# EAGLE design Relays_Multiplexer (EAGLE 9.3.0)
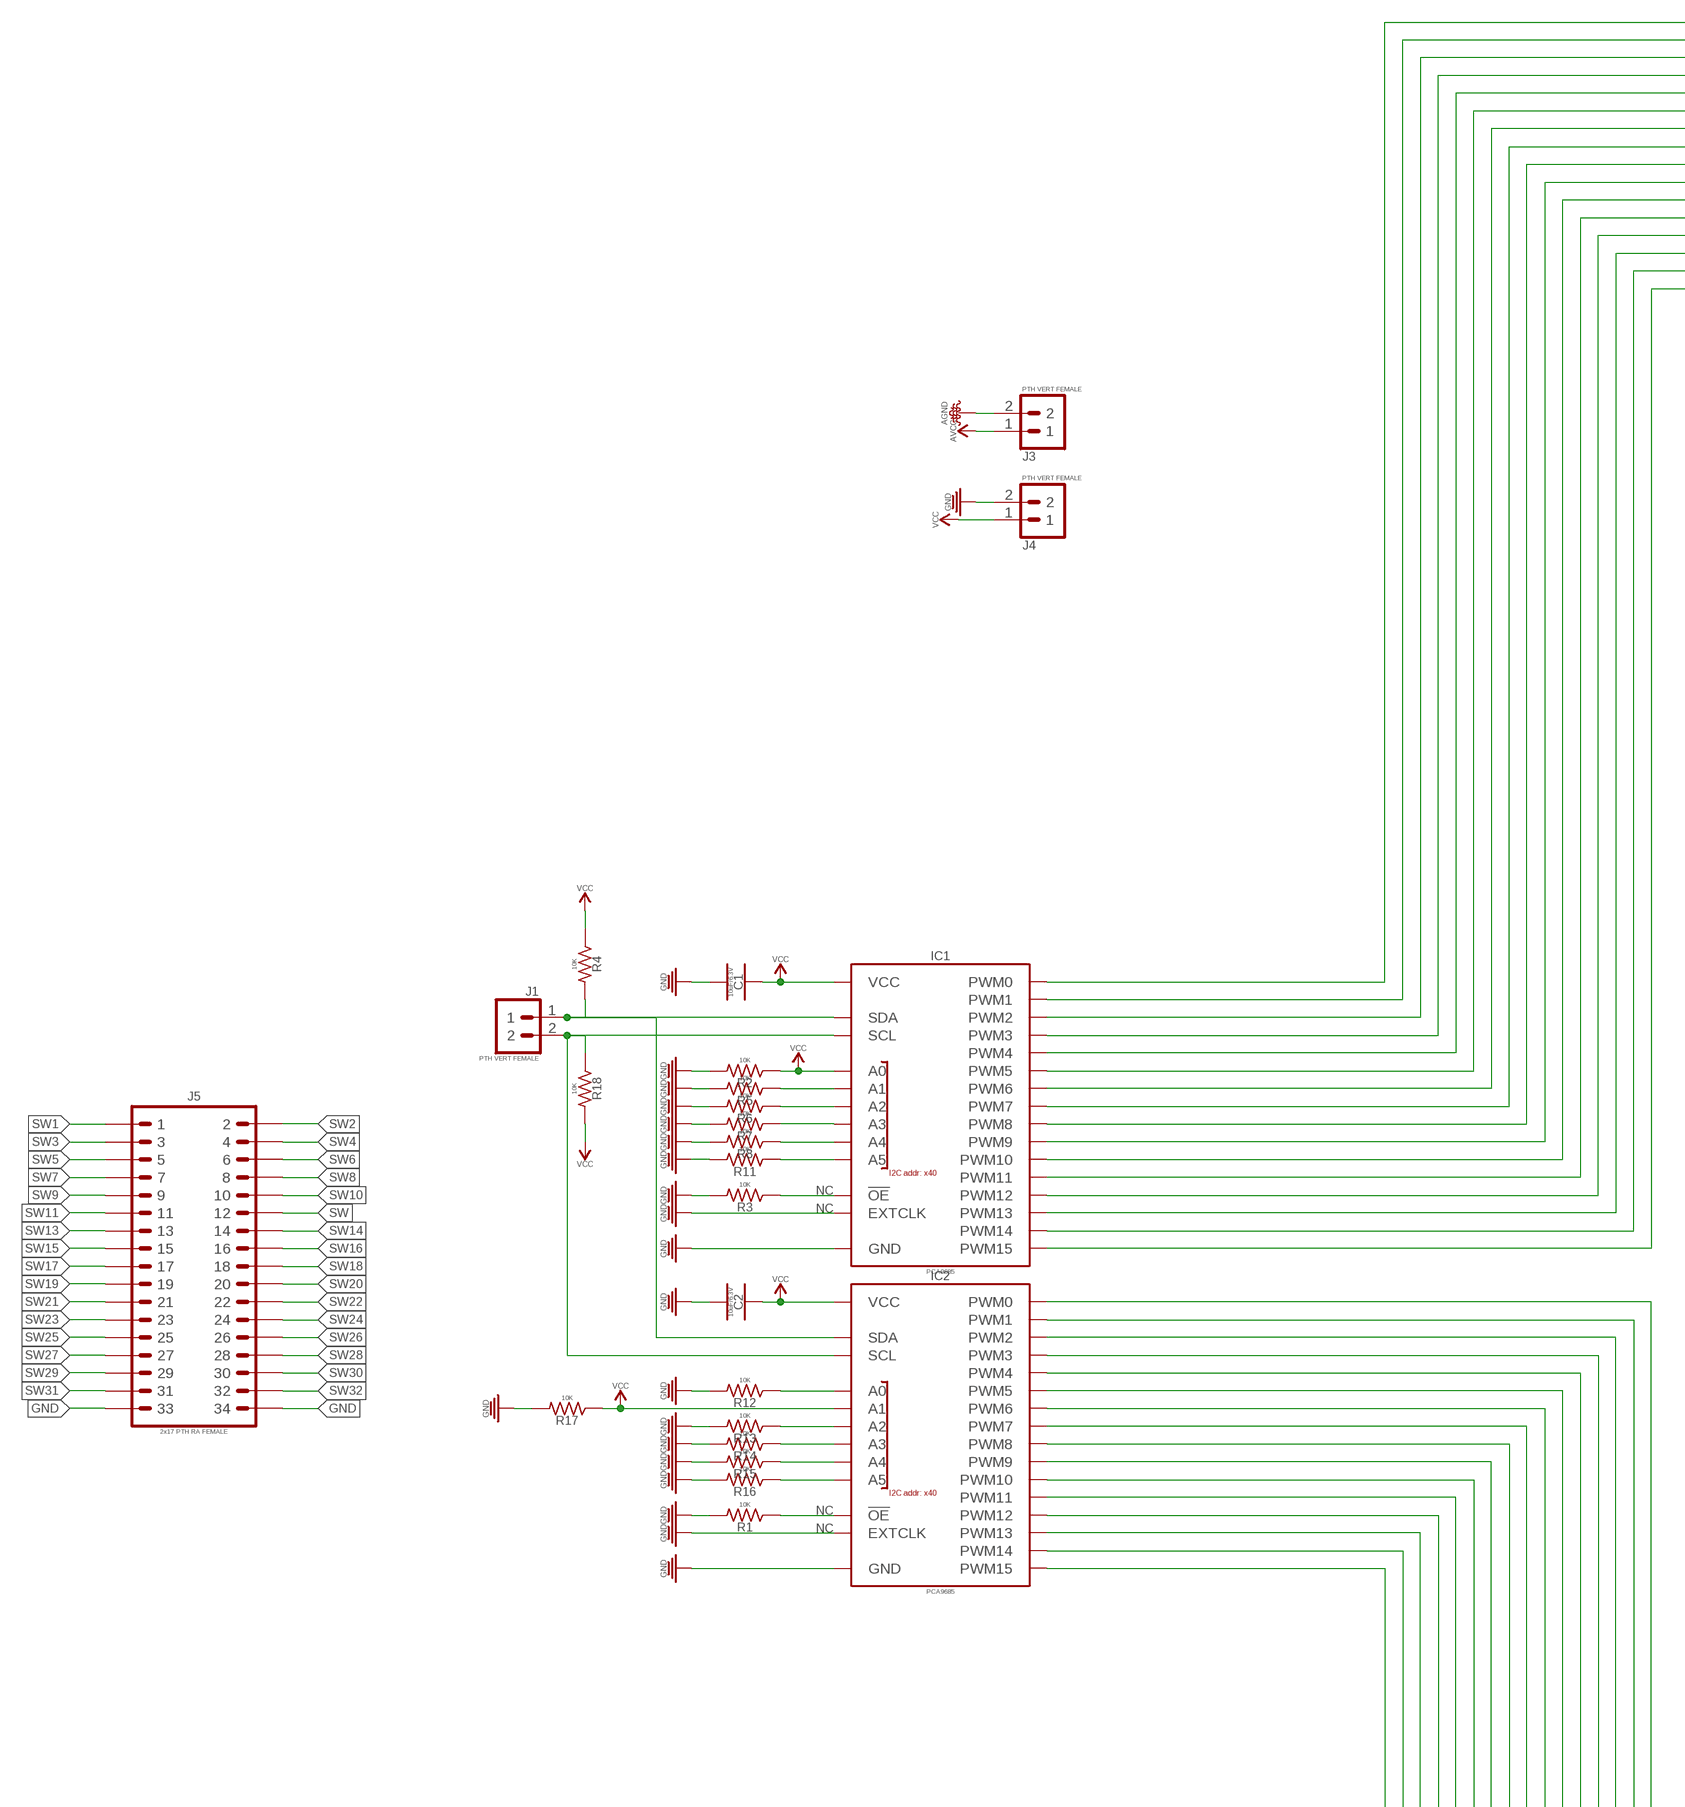
[diagram p0: schematic, sheet 1, part 1 of 3]
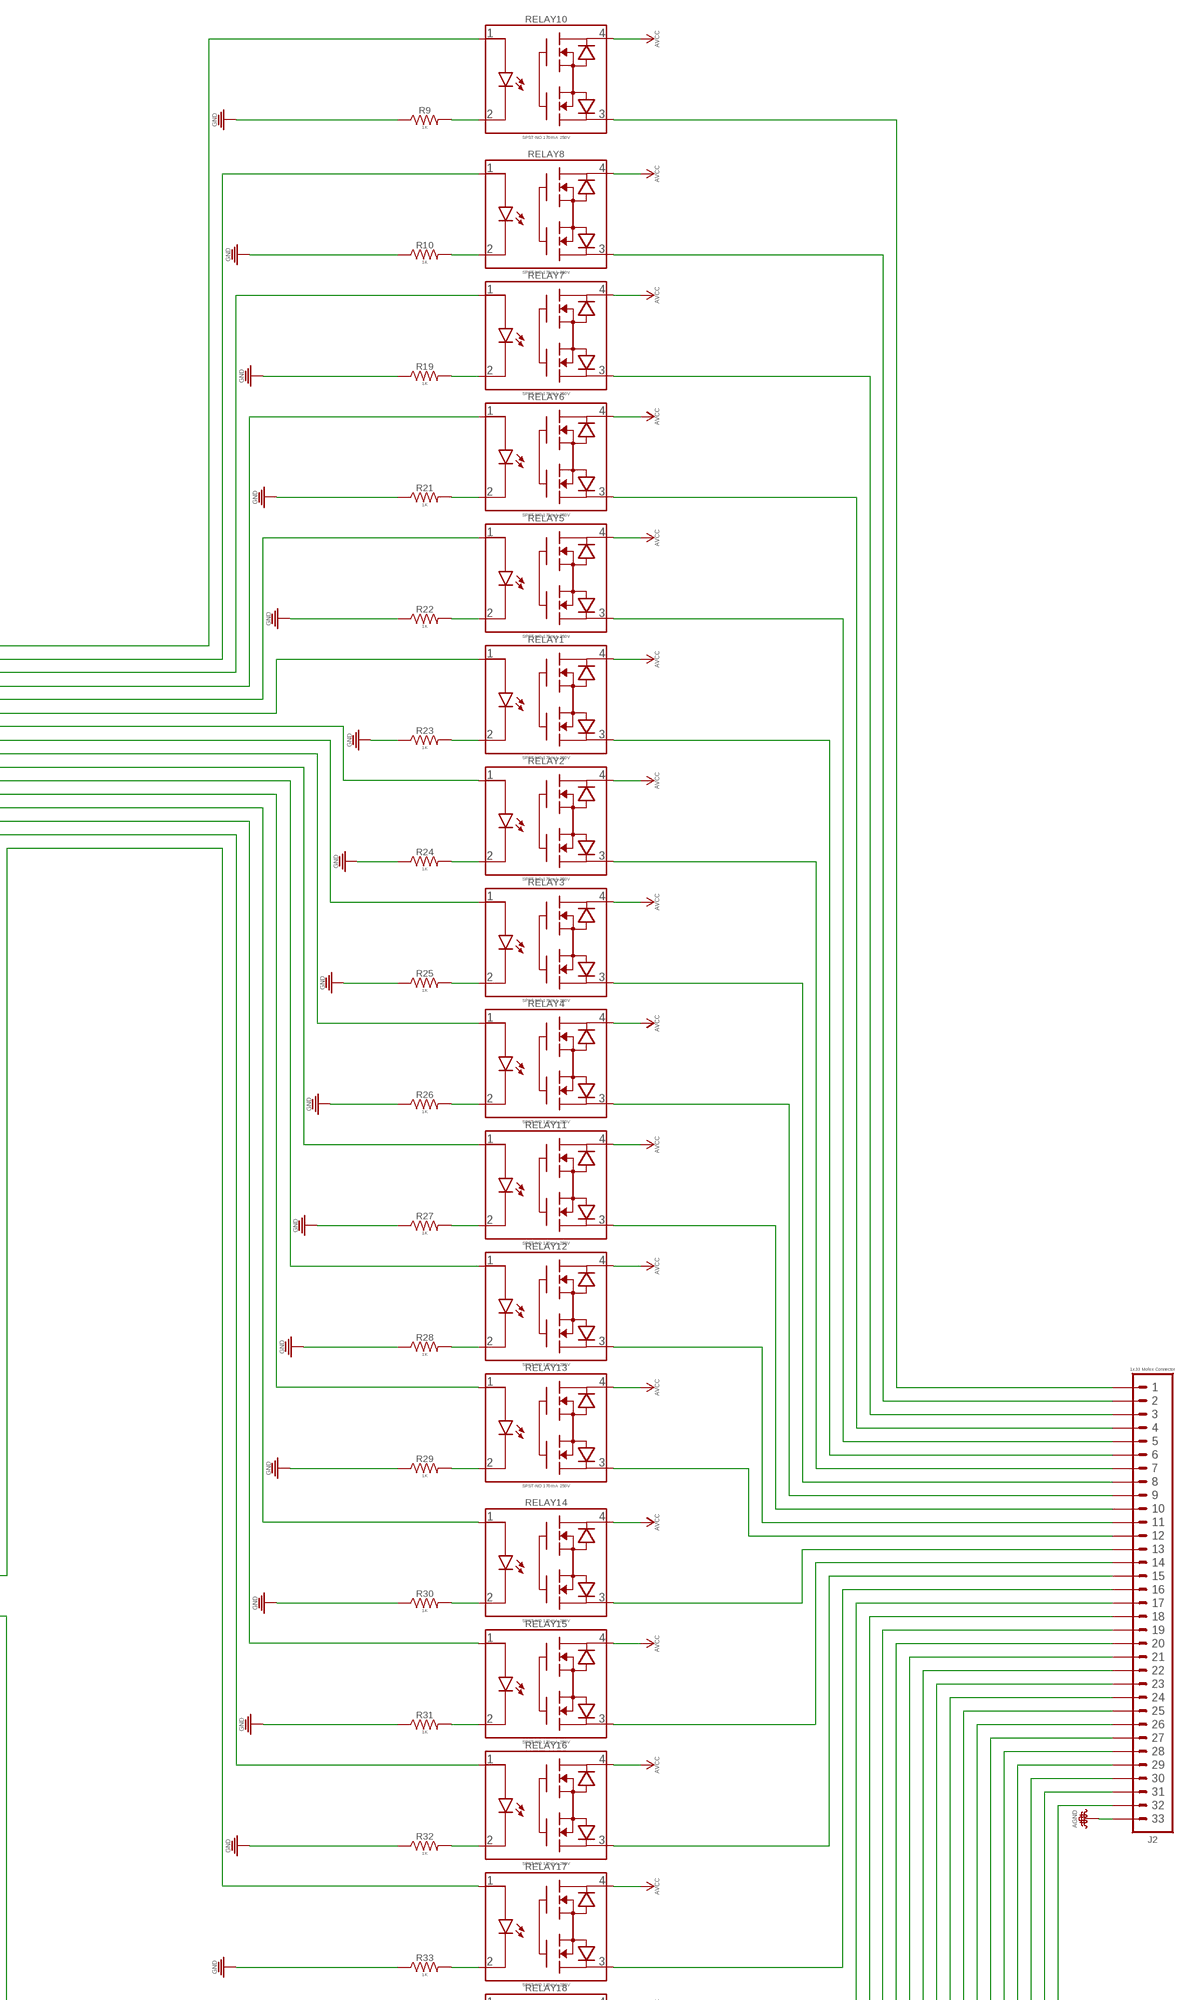
[diagram p1: schematic, sheet 1, part 2 of 3]
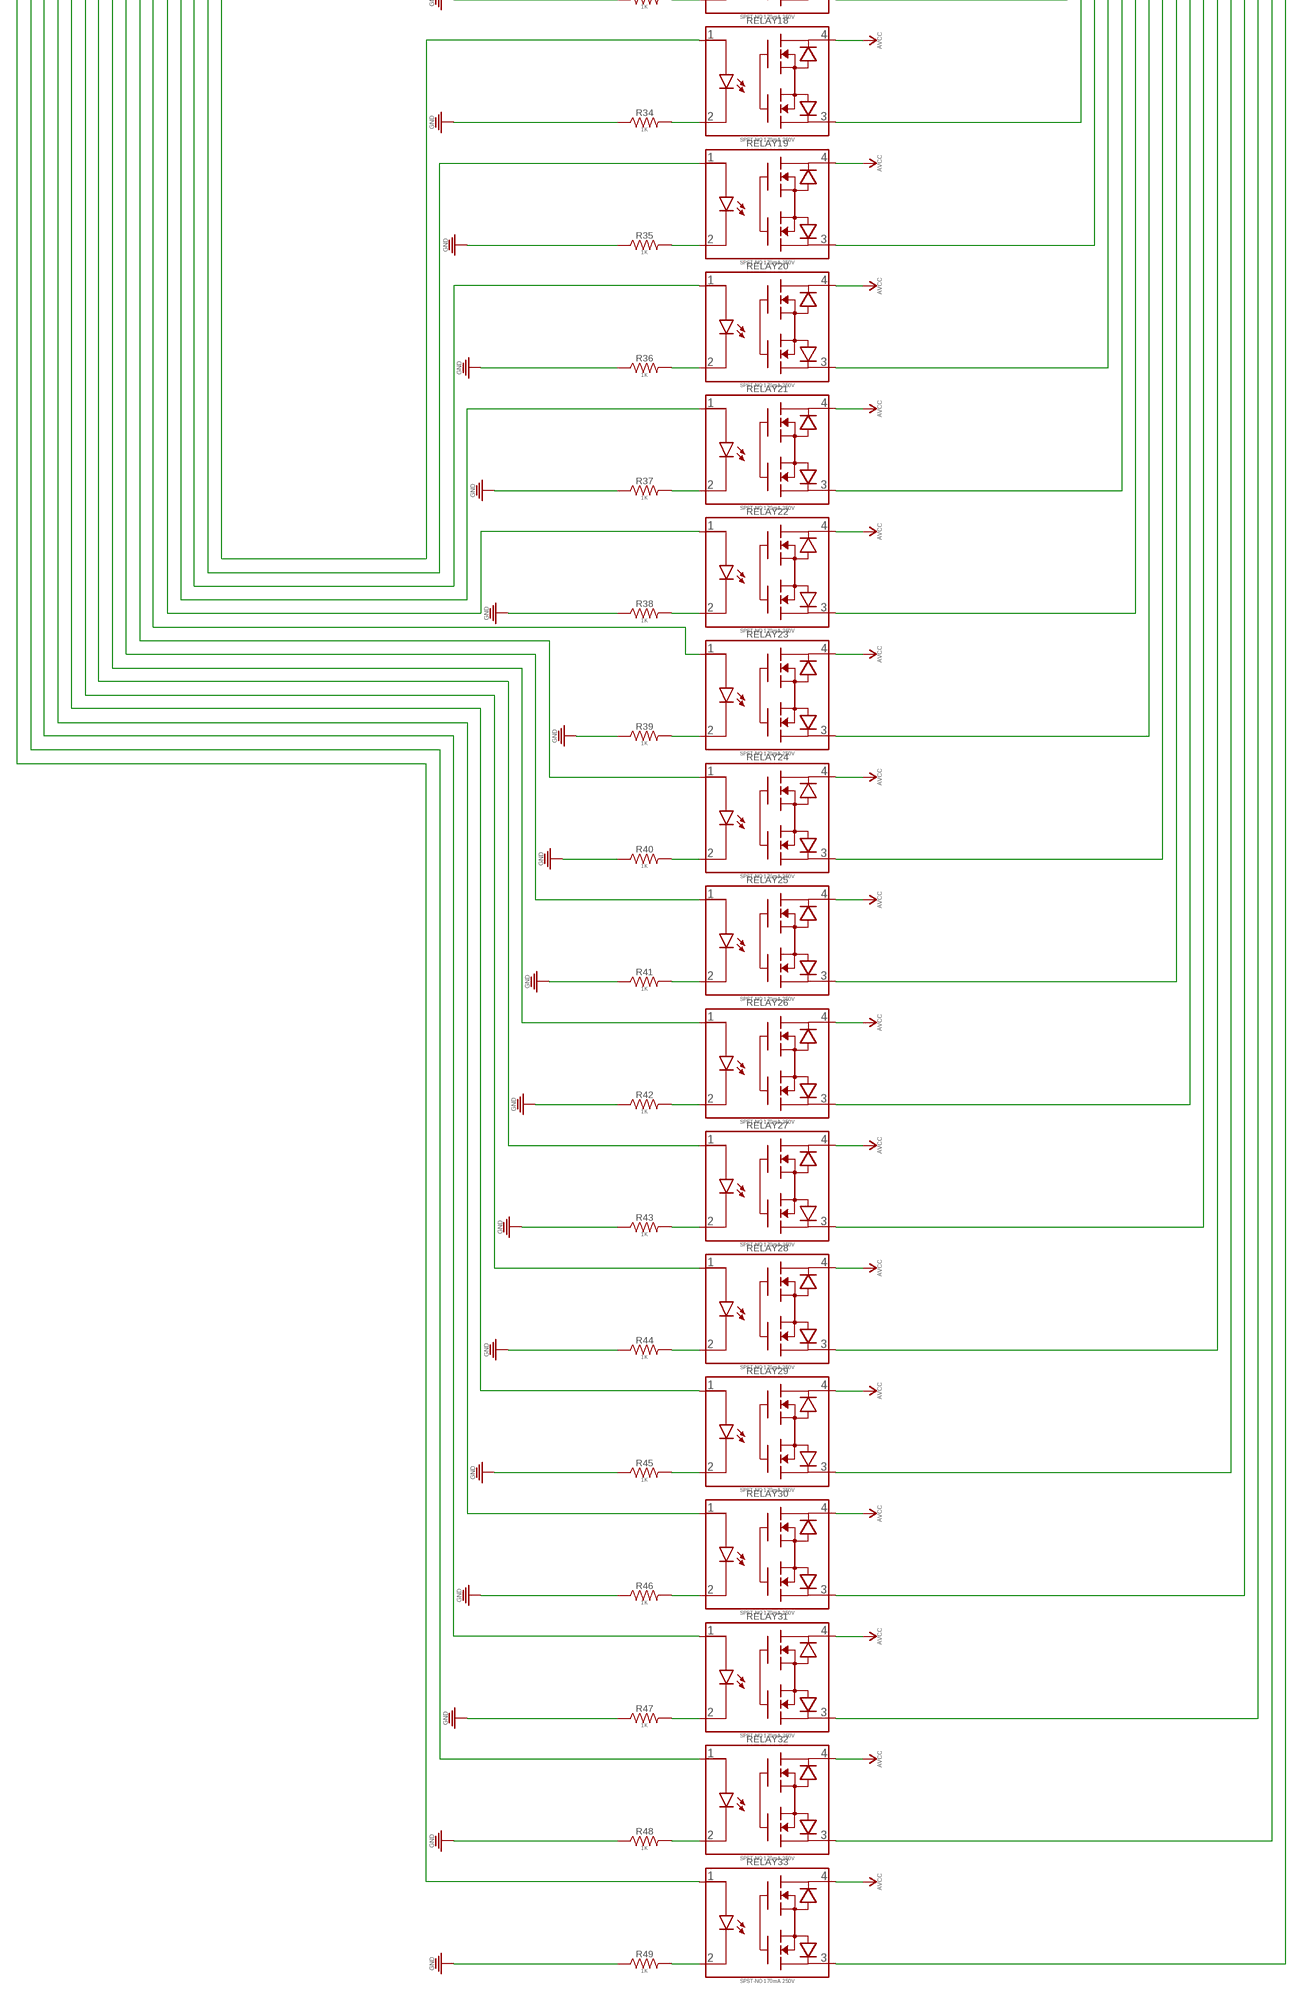
[diagram p2: schematic, sheet 1, part 3 of 3]

## Parts
C1  10uF/6.3V  10UF_CER_SMD-0402_6.3V-20%  [CAPC1005X55_SMD-0402]
C2  10uF/6.3V  10UF_CER_SMD-0402_6.3V-20%  [CAPC1005X55_SMD-0402]
IC1  PCA9685  PCA9685_16-CH_12-BIT_PWM-DRIVER_TSSOP-28_PWM-DRIVER_16CH  [SOP65P650X110-28]
IC2  PCA9685  PCA9685_16-CH_12-BIT_PWM-DRIVER_TSSOP-28_PWM-DRIVER_16CH  [SOP65P650X110-28]
J1  PTH VERT FEMALE  1X02_PTH_VERT_FEMALE_2.54MM  [HDRVR2W64P254_1X2_558X254X850B]
J2  1x33 Molex Connector  1X33_MOLEX_FPC_FPC_RIBBON-CABLE  [_MOLEX-5025983393_FPC_PITCH-0.3MM]
J3  PTH VERT FEMALE  1X02_PTH_VERT_FEMALE_2.54MM  [HDRVR2W64P254_1X2_558X254X850B]
J4  PTH VERT FEMALE  1X02_PTH_VERT_FEMALE_2.54MM  [HDRVR2W64P254_1X2_558X254X850B]
J5  2x17 PTH RA FEMALE  2X17_PTH_RA-FEMALE  [2X17-RA-FEMALE]
R1  10K  10KΩ_SMD-0402_1/16W-5%  [RESC1005X35_SMD-0402]
R2  10K  10KΩ_SMD-0402_1/16W-5%  [RESC1005X35_SMD-0402]
R3  10K  10KΩ_SMD-0402_1/16W-5%  [RESC1005X35_SMD-0402]
R4  10K  10KΩ_SMD-0402_1/16W-5%  [RESC1005X35_SMD-0402]
R5  10K  10KΩ_SMD-0402_1/16W-5%  [RESC1005X35_SMD-0402]
R6  10K  10KΩ_SMD-0402_1/16W-5%  [RESC1005X35_SMD-0402]
R7  10K  10KΩ_SMD-0402_1/16W-5%  [RESC1005X35_SMD-0402]
R8  10K  10KΩ_SMD-0402_1/16W-5%  [RESC1005X35_SMD-0402]
R9  1K  1KΩ_SMD-0402_1/16W-5%  [RESC1005X35_SMD-0402]
R10  1K  1KΩ_SMD-0402_1/16W-5%  [RESC1005X35_SMD-0402]
R11  10K  10KΩ_SMD-0402_1/16W-5%  [RESC1005X35_SMD-0402]
R12  10K  10KΩ_SMD-0402_1/16W-5%  [RESC1005X35_SMD-0402]
R13  10K  10KΩ_SMD-0402_1/16W-5%  [RESC1005X35_SMD-0402]
R14  10K  10KΩ_SMD-0402_1/16W-5%  [RESC1005X35_SMD-0402]
R15  10K  10KΩ_SMD-0402_1/16W-5%  [RESC1005X35_SMD-0402]
R16  10K  10KΩ_SMD-0402_1/16W-5%  [RESC1005X35_SMD-0402]
R17  10K  10KΩ_SMD-0402_1/16W-5%  [RESC1005X35_SMD-0402]
R18  10K  10KΩ_SMD-0402_1/16W-5%  [RESC1005X35_SMD-0402]
R19  1K  1KΩ_SMD-0402_1/16W-5%  [RESC1005X35_SMD-0402]
R21  1K  1KΩ_SMD-0402_1/16W-5%  [RESC1005X35_SMD-0402]
R22  1K  1KΩ_SMD-0402_1/16W-5%  [RESC1005X35_SMD-0402]
R23  1K  1KΩ_SMD-0402_1/16W-5%  [RESC1005X35_SMD-0402]
R24  1K  1KΩ_SMD-0402_1/16W-5%  [RESC1005X35_SMD-0402]
R25  1K  1KΩ_SMD-0402_1/16W-5%  [RESC1005X35_SMD-0402]
R26  1K  1KΩ_SMD-0402_1/16W-5%  [RESC1005X35_SMD-0402]
R27  1K  1KΩ_SMD-0402_1/16W-5%  [RESC1005X35_SMD-0402]
R28  1K  1KΩ_SMD-0402_1/16W-5%  [RESC1005X35_SMD-0402]
R29  1K  1KΩ_SMD-0402_1/16W-5%  [RESC1005X35_SMD-0402]
R30  1K  1KΩ_SMD-0402_1/16W-5%  [RESC1005X35_SMD-0402]
R31  1K  1KΩ_SMD-0402_1/16W-5%  [RESC1005X35_SMD-0402]
R32  1K  1KΩ_SMD-0402_1/16W-5%  [RESC1005X35_SMD-0402]
R33  1K  1KΩ_SMD-0402_1/16W-5%  [RESC1005X35_SMD-0402]
R34  1K  1KΩ_SMD-0402_1/16W-5%  [RESC1005X35_SMD-0402]
R35  1K  1KΩ_SMD-0402_1/16W-5%  [RESC1005X35_SMD-0402]
R36  1K  1KΩ_SMD-0402_1/16W-5%  [RESC1005X35_SMD-0402]
R37  1K  1KΩ_SMD-0402_1/16W-5%  [RESC1005X35_SMD-0402]
R38  1K  1KΩ_SMD-0402_1/16W-5%  [RESC1005X35_SMD-0402]
R39  1K  1KΩ_SMD-0402_1/16W-5%  [RESC1005X35_SMD-0402]
R40  1K  1KΩ_SMD-0402_1/16W-5%  [RESC1005X35_SMD-0402]
R41  1K  1KΩ_SMD-0402_1/16W-5%  [RESC1005X35_SMD-0402]
R42  1K  1KΩ_SMD-0402_1/16W-5%  [RESC1005X35_SMD-0402]
R43  1K  1KΩ_SMD-0402_1/16W-5%  [RESC1005X35_SMD-0402]
R44  1K  1KΩ_SMD-0402_1/16W-5%  [RESC1005X35_SMD-0402]
R45  1K  1KΩ_SMD-0402_1/16W-5%  [RESC1005X35_SMD-0402]
R46  1K  1KΩ_SMD-0402_1/16W-5%  [RESC1005X35_SMD-0402]
R47  1K  1KΩ_SMD-0402_1/16W-5%  [RESC1005X35_SMD-0402]
R48  1K  1KΩ_SMD-0402_1/16W-5%  [RESC1005X35_SMD-0402]
R49  1K  1KΩ_SMD-0402_1/16W-5%  [RESC1005X35_SMD-0402]
RELAY1  SPST-NO 170mA 250V  RELAY_SOLID-STATE_SSR_170MA_250V_SPST-NO  [SOP254P609X203-4]
RELAY2  SPST-NO 170mA 250V  RELAY_SOLID-STATE_SSR_170MA_250V_SPST-NO  [SOP254P609X203-4]
RELAY3  SPST-NO 170mA 250V  RELAY_SOLID-STATE_SSR_170MA_250V_SPST-NO  [SOP254P609X203-4]
RELAY4  SPST-NO 170mA 250V  RELAY_SOLID-STATE_SSR_170MA_250V_SPST-NO  [SOP254P609X203-4]
RELAY5  SPST-NO 170mA 250V  RELAY_SOLID-STATE_SSR_170MA_250V_SPST-NO  [SOP254P609X203-4]
RELAY6  SPST-NO 170mA 250V  RELAY_SOLID-STATE_SSR_170MA_250V_SPST-NO  [SOP254P609X203-4]
RELAY7  SPST-NO 170mA 250V  RELAY_SOLID-STATE_SSR_170MA_250V_SPST-NO  [SOP254P609X203-4]
RELAY8  SPST-NO 170mA 250V  RELAY_SOLID-STATE_SSR_170MA_250V_SPST-NO  [SOP254P609X203-4]
RELAY10  SPST-NO 170mA 250V  RELAY_SOLID-STATE_SSR_170MA_250V_SPST-NO  [SOP254P609X203-4]
RELAY11  SPST-NO 170mA 250V  RELAY_SOLID-STATE_SSR_170MA_250V_SPST-NO  [SOP254P609X203-4]
RELAY12  SPST-NO 170mA 250V  RELAY_SOLID-STATE_SSR_170MA_250V_SPST-NO  [SOP254P609X203-4]
RELAY13  SPST-NO 170mA 250V  RELAY_SOLID-STATE_SSR_170MA_250V_SPST-NO  [SOP254P609X203-4]
RELAY14  SPST-NO 170mA 250V  RELAY_SOLID-STATE_SSR_170MA_250V_SPST-NO  [SOP254P609X203-4]
RELAY15  SPST-NO 170mA 250V  RELAY_SOLID-STATE_SSR_170MA_250V_SPST-NO  [SOP254P609X203-4]
RELAY16  SPST-NO 170mA 250V  RELAY_SOLID-STATE_SSR_170MA_250V_SPST-NO  [SOP254P609X203-4]
RELAY17  SPST-NO 170mA 250V  RELAY_SOLID-STATE_SSR_170MA_250V_SPST-NO  [SOP254P609X203-4]
RELAY18  SPST-NO 170mA 250V  RELAY_SOLID-STATE_SSR_170MA_250V_SPST-NO  [SOP254P609X203-4]
RELAY19  SPST-NO 170mA 250V  RELAY_SOLID-STATE_SSR_170MA_250V_SPST-NO  [SOP254P609X203-4]
RELAY20  SPST-NO 170mA 250V  RELAY_SOLID-STATE_SSR_170MA_250V_SPST-NO  [SOP254P609X203-4]
RELAY21  SPST-NO 170mA 250V  RELAY_SOLID-STATE_SSR_170MA_250V_SPST-NO  [SOP254P609X203-4]
RELAY22  SPST-NO 170mA 250V  RELAY_SOLID-STATE_SSR_170MA_250V_SPST-NO  [SOP254P609X203-4]
RELAY23  SPST-NO 170mA 250V  RELAY_SOLID-STATE_SSR_170MA_250V_SPST-NO  [SOP254P609X203-4]
RELAY24  SPST-NO 170mA 250V  RELAY_SOLID-STATE_SSR_170MA_250V_SPST-NO  [SOP254P609X203-4]
RELAY25  SPST-NO 170mA 250V  RELAY_SOLID-STATE_SSR_170MA_250V_SPST-NO  [SOP254P609X203-4]
RELAY26  SPST-NO 170mA 250V  RELAY_SOLID-STATE_SSR_170MA_250V_SPST-NO  [SOP254P609X203-4]
RELAY27  SPST-NO 170mA 250V  RELAY_SOLID-STATE_SSR_170MA_250V_SPST-NO  [SOP254P609X203-4]
RELAY28  SPST-NO 170mA 250V  RELAY_SOLID-STATE_SSR_170MA_250V_SPST-NO  [SOP254P609X203-4]
RELAY29  SPST-NO 170mA 250V  RELAY_SOLID-STATE_SSR_170MA_250V_SPST-NO  [SOP254P609X203-4]
RELAY30  SPST-NO 170mA 250V  RELAY_SOLID-STATE_SSR_170MA_250V_SPST-NO  [SOP254P609X203-4]
RELAY31  SPST-NO 170mA 250V  RELAY_SOLID-STATE_SSR_170MA_250V_SPST-NO  [SOP254P609X203-4]
RELAY32  SPST-NO 170mA 250V  RELAY_SOLID-STATE_SSR_170MA_250V_SPST-NO  [SOP254P609X203-4]
RELAY33  SPST-NO 170mA 250V  RELAY_SOLID-STATE_SSR_170MA_250V_SPST-NO  [SOP254P609X203-4]

## Nets
AGND: J2.P$33 J3.2
AVCC: J3.1 RELAY1.4 RELAY2.4 RELAY3.4 RELAY4.4 RELAY5.4 RELAY6.4 RELAY7.4 RELAY8.4 RELAY10.4 RELAY11.4 RELAY12.4 RELAY13.4 RELAY14.4 RELAY15.4 RELAY16.4 RELAY17.4 RELAY18.4 RELAY19.4 RELAY20.4 RELAY21.4 RELAY22.4 RELAY23.4 RELAY24.4 RELAY25.4 RELAY26.4 RELAY27.4 RELAY28.4 RELAY29.4 RELAY30.4 RELAY31.4 RELAY32.4 RELAY33.4
GND: C1.2 C2.2 IC1.14(GND) IC1.25(EXTCLK) IC2.14(GND) IC2.25(EXTCLK) J4.2 J5.33 J5.34 R1.2 R2.2 R3.2 R5.2 R6.2 R7.2 R8.2 R9.1 R10.1 R11.2 R12.2 R13.2 R14.2 R15.2 R16.2 R17.2 R19.1 R21.1 R22.1 R23.1 R24.1 R25.1 R26.1 R27.1 R28.1 R29.1 R30.1 R31.1 R32.1 R33.1 R34.1 R35.1 R36.1 R37.1 R38.1 R39.1 R40.1 R41.1 R42.1 R43.1 R44.1 R45.1 R46.1 R47.1 R48.1 R49.1
N$1: IC1.23(!OE) R3.1
N$2: IC1.4(A3) R7.1
N$3: IC1.24(A5) R11.1
N$4: IC1.5(A4) R8.1
N$5: IC1.3(A2) R6.1
N$6: IC1.2(A1) R5.1
N$7: IC2.1(A0) R12.1
N$8: IC2.3(A2) R13.1
N$9: IC2.4(A3) R14.1
N$10: IC2.5(A4) R15.1
N$11: IC2.24(A5) R16.1
N$12: IC2.23(!OE) R1.1
N$17: J2.P$17 RELAY18.3
N$18: J2.P$16 RELAY17.3
N$19: J2.P$15 RELAY16.3
N$20: J2.P$14 RELAY15.3
N$21: J2.P$13 RELAY14.3
N$22: J2.P$12 RELAY13.3
N$23: J2.P$11 RELAY12.3
N$24: J2.P$10 RELAY11.3
N$25: J2.P$9 RELAY4.3
N$26: J2.P$8 RELAY3.3
N$27: J2.P$7 RELAY2.3
N$28: J2.P$6 RELAY1.3
N$29: J2.P$5 RELAY5.3
N$30: J2.P$4 RELAY6.3
N$31: J2.P$3 RELAY7.3
N$32: J2.P$2 RELAY8.3
N$33: J2.P$1 RELAY10.3
N$34: J2.P$18 RELAY19.3
N$35: J2.P$19 RELAY20.3
N$36: J2.P$20 RELAY21.3
N$37: J2.P$21 RELAY22.3
N$38: J2.P$22 RELAY23.3
N$39: J2.P$23 RELAY24.3
N$40: J2.P$24 RELAY25.3
N$41: J2.P$25 RELAY26.3
N$42: J2.P$26 RELAY27.3
N$43: J2.P$27 RELAY28.3
N$44: J2.P$28 RELAY29.3
N$45: J2.P$29 RELAY30.3
N$46: J2.P$30 RELAY31.3
N$52: J2.P$31 RELAY32.3
N$53: J2.P$32 RELAY33.3
N$79: R19.2 RELAY7.2
N$80: R21.2 RELAY6.2
N$81: R9.2 RELAY10.2
N$82: R10.2 RELAY8.2
N$83: R22.2 RELAY5.2
N$84: R23.2 RELAY1.2
N$85: R24.2 RELAY2.2
N$86: R25.2 RELAY3.2
N$87: R26.2 RELAY4.2
N$88: R27.2 RELAY11.2
N$89: R28.2 RELAY12.2
N$90: R29.2 RELAY13.2
N$91: R30.2 RELAY14.2
N$92: R31.2 RELAY15.2
N$93: R32.2 RELAY16.2
N$94: R33.2 RELAY17.2
N$95: R34.2 RELAY18.2
N$96: R35.2 RELAY19.2
N$97: R36.2 RELAY20.2
N$98: R37.2 RELAY21.2
N$99: R38.2 RELAY22.2
N$100: R39.2 RELAY23.2
N$101: R40.2 RELAY24.2
N$102: R41.2 RELAY25.2
N$103: R42.2 RELAY26.2
N$104: R43.2 RELAY27.2
N$105: R44.2 RELAY28.2
N$106: R45.2 RELAY29.2
N$107: R46.2 RELAY30.2
N$108: R47.2 RELAY31.2
N$109: R48.2 RELAY32.2
N$110: R49.2 RELAY33.2
SCL: IC1.26(SCL) IC2.26(SCL) J1.2 R18.1
SDA: IC1.27(SDA) IC2.27(SDA) J1.1 R4.2
SW: IC1.18(PWM11) J5.12 RELAY13.1
SW1: IC1.6(PWM0) J5.1 RELAY10.1
SW2: IC1.7(PWM1) J5.2 RELAY8.1
SW3: IC1.8(PWM2) J5.3 RELAY7.1
SW4: IC1.9(PWM3) J5.4 RELAY6.1
SW5: IC1.10(PWM4) J5.5 RELAY5.1
SW6: IC1.11(PWM5) J5.6 RELAY1.1
SW7: IC1.12(PWM6) J5.7 RELAY2.1
SW8: IC1.13(PWM7) J5.8 RELAY3.1
SW9: IC1.15(PWM8) J5.9 RELAY4.1
SW10: IC1.16(PWM9) J5.10 RELAY11.1
SW11: IC1.17(PWM10) J5.11 RELAY12.1
SW13: IC1.19(PWM12) J5.13 RELAY14.1
SW14: IC1.20(PWM13) J5.14 RELAY15.1
SW15: IC1.21(PWM14) J5.15 RELAY16.1
SW16: IC1.22(PWM15) J5.16 RELAY17.1
SW17: IC2.6(PWM0) J5.17 RELAY18.1
SW18: IC2.7(PWM1) J5.18 RELAY19.1
SW19: IC2.8(PWM2) J5.19 RELAY20.1
SW20: IC2.9(PWM3) J5.20 RELAY21.1
SW21: IC2.10(PWM4) J5.21 RELAY22.1
SW22: IC2.11(PWM5) J5.22 RELAY23.1
SW23: IC2.12(PWM6) J5.23 RELAY24.1
SW24: IC2.13(PWM7) J5.24 RELAY25.1
SW25: IC2.15(PWM8) J5.25 RELAY26.1
SW26: IC2.16(PWM9) J5.26 RELAY27.1
SW27: IC2.17(PWM10) J5.27 RELAY28.1
SW28: IC2.18(PWM11) J5.28 RELAY29.1
SW29: IC2.19(PWM12) J5.29 RELAY30.1
SW30: IC2.20(PWM13) J5.30 RELAY31.1
SW31: IC2.21(PWM14) J5.31 RELAY32.1
SW32: IC2.22(PWM15) J5.32 RELAY33.1
VCC: C1.1 C2.1 IC1.1(A0) IC1.28(VCC) IC2.2(A1) IC2.28(VCC) J4.1 R2.1 R4.1 R17.1 R18.2

## Library data of the parts
C1 C2 = _capacitors:10UF; DATASHEET: https://www.murata.com/~/media/webrenewal/support/library/catalog/products/capacitor/mlcc/c02e.ashx; DIST: Digikey; DISTLINK: https://www.digikey.com/products/en?keywords=490-13233-1-ND; DISTPN: 490-13233-1-ND; MFR: Murata Electronics North America; MPN: GRM155C80J106ME11D
IC1 IC2 = _special:PCA9685_16-CH_12-BIT_PWM-DRIVER; DATASHEET: https://www.nxp.com/docs/en/data-sheet/PCA9685.pdf; DIST: Digikey; DISTLINK: https://www.digikey.com/products/en?keywords=568-11925-1-ND; DISTPN: 568-11925-1-ND; MFR: NXP USA Inc.; MPN: PCA9685PW,118
J1 J3 J4 = _connectors:1X02: 2 Positions Header Connector 0.079" (2.00mm) Through Hole Tin; DATASHEET: https://drawings-pdf.s3.amazonaws.com/10492.pdf; DIST: Digikey; DISTLINK: https://www.digikey.com/products/en?keywords=PPTC021LFBN-RC; DISTPN: S7000-ND; MFR: Sullins Connector Solutions; MPN: PPTC021LFBN-RC
J2 = _connectors:1X33_MOLEX_FPC; DATASHEET: https://www.molex.com/pdm_docs/sd/5025982593_sd.pdf; DATASHEET_CABLE: https://www.molex.com/pdm_docs/sd/150150423_sd.pdf; DIST: Digikey; DISTLINK: https://www.digikey.com/products/en?keywords=WM9775CT-ND; DISTLINK_CABLE: https://www.digikey.com/products/en?keywords=WM9647-ND; DISTPN: WM9775CT-ND; DISTPN_CABLE: WM9647-ND; DIST_CABLE: Digikey; MFR: Molex, LLC; MFR_CABLE: Molex, LLC; MPN: 5025983393; MPN_CABLE: 0150150233
J5 = _connectors:2X17; DATASHEET: http://suddendocs.samtec.com/prints/ssq-1xx-xx-xxx-x-xx-xxx-xx-x-mkt.pdf; DIST: Digikey; DISTLINK: https://www.digikey.com/products/en?keywords=SAM1224-17-ND; DISTPN: SAM1224-17-ND; MFR: Samtec Inc.; MPN: SSQ-117-02-T-D-RA
R1-R8 R11-R18 = _resistors:10KΩ; DATASHEET: http://www.yageo.com/NewPortal/yageodocoutput?fileName=/pdf/R-Chip/PYu-RC_51_RoHS_P_0.pdf; DIST: Digikey; DISTLINK: https://www.digikey.com/products/en?keywords=YAG1281CT-ND; DISTPN: YAG1281CT-ND; MFR: Yageo; MPN: RC0402JR-0710KP
R9 R10 R19 R21-R49 = _resistors:1KΩ; DATASHEET: http://www.yageo.com/documents/recent/PYu-RC_Group_51_RoHS_L_9.pdf; DIST: Digikey; DISTLINK: https://www.digikey.com/products/en?keywords=311-1.0KJRCT-ND; DISTPN: 311-1.0KJRCT-ND; MFR: Yageo; MPN: RC0402JR-071KL
RELAY1-RELAY8 RELAY10-RELAY33 = _relay:RELAY_SOLID-STATE; DATASHEET: http://www.ixysic.com/home/pdfs.nsf/www/CPC1010N.pdf/$file/CPC1010N.pdf; DIST: Digikey; DISTLINK: https://www.digikey.com/products/en?keywords=CPC1010N-ND; DISTPN: CPC1010N-ND; MFR: IXYS Integrated Circuits Division; MPN: CPC1010N

## Board
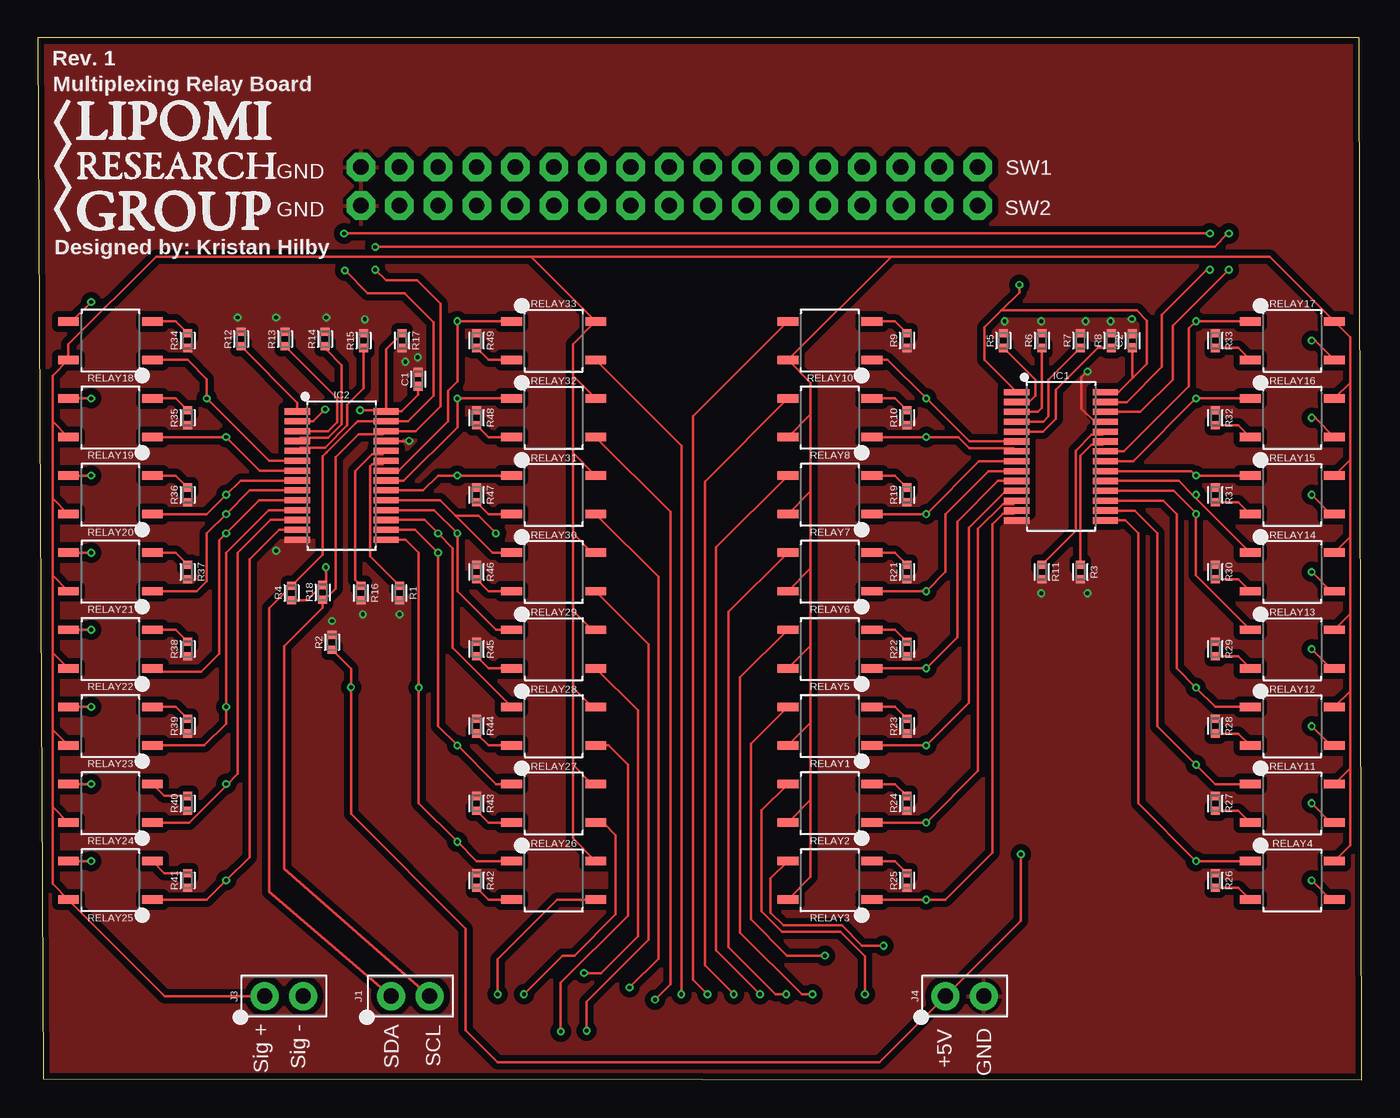
[diagram p3: board, top side]
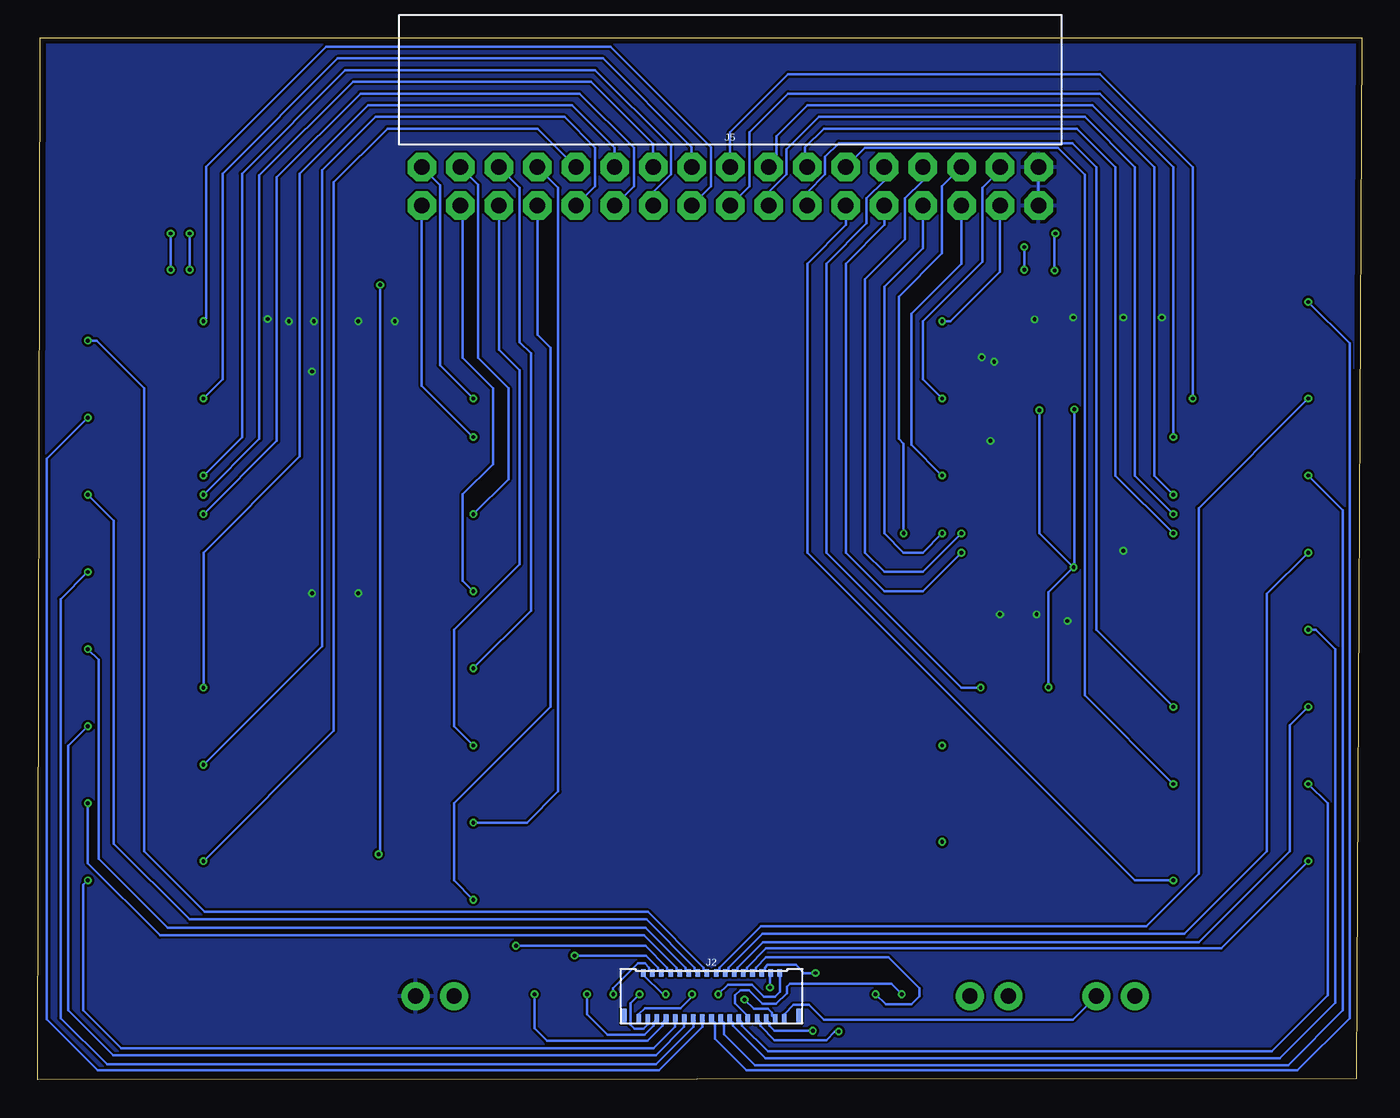
[diagram p4: board, bottom side, seen from below]

Size 87.23 x 68.62 mm. Coordinates in mm from the lower left corner, seen from the top.
Outline: 0.35,0.05 87.23,0 87.08,68.62 0,68.62 0.35,0.05
Copper layers (1*16): Top 0.035559375mm / dielectric 1.6mm / Bottom 0.035559375mm
Design rules "oshpark-2layer": minimum track width 6mil, minimum drill 10mil, track to track 6mil, track to pad 6mil, pad to pad 6mil, via to via 6mil, smd to smd 6mil, copper to edge 15mil, drill to drill 6mil, minimum pad ring 5mil, minimum via ring 5mil, stop-mask expansion 2.5mil, vias tented up to drill 0mil, thermal gap 10mil

### Footprints (pad centres in the part's own frame; a part is rotated, then mirrored left to right if it is on the bottom)
CAPC1005X55_SMD-0402 = smd 0.585 x 0.612: 1 -0.458,0; 2 0.458,0
SOP65P650X110-28 = smd 1.659 x 0.407: 1 -2.926,4.225; 2 -2.926,3.575; 3 -2.926,2.925; 4 -2.926,2.275; 5 -2.926,1.625; 6 -2.926,0.975; 7 -2.926,0.325; 8 -2.926,-0.325; 9 -2.926,-0.975; 10 -2.926,-1.625; 11 -2.926,-2.275; 12 -2.926,-2.925; 13 -2.926,-3.575; 14 -2.926,-4.225; 15 2.926,-4.225; 16 2.926,-3.575; 17 2.926,-2.925; 18 2.926,-2.275; 19 2.926,-1.625; 20 2.926,-0.975; 21 2.926,-0.325; 22 2.926,0.325; 23 2.926,0.975; 24 2.926,1.625; 25 2.926,2.275; 26 2.926,2.925; 27 2.926,3.575; 28 2.926,4.225
HDRVR2W64P254_1X2_558X254X850B = drill 1 pad 1.85: 1 0,0; 2 2.54,0
_MOLEX-5025983393_FPC_PITCH-0.3MM = smd 0.3 x 0.67: P$1 -4.8,-1.532; P$3 -4.2,-1.532; P$5 -3.6,-1.532; P$7 -3,-1.532; P$9 -2.4,-1.532; P$11 -1.8,-1.532; P$13 -1.2,-1.532; P$15 -0.6,-1.532; P$17 0,-1.532; P$19 0.6,-1.532; P$21 1.2,-1.532; P$23 1.8,-1.532; P$25 2.4,-1.532; P$27 3,-1.532; P$29 3.6,-1.532; P$31 4.2,-1.532; P$33 4.8,-1.532 | smd 0.3 x 0.5: P$2 -4.5,1.532; P$4 -3.9,1.532; P$6 -3.3,1.532; P$8 -2.7,1.532; P$10 -2.1,1.532; P$12 -1.5,1.532; P$14 -0.9,1.532; P$16 -0.3,1.532; P$18 0.3,1.532; P$20 0.9,1.532; P$22 1.5,1.532; P$24 2.1,1.532; P$26 2.7,1.532; P$28 3.3,1.532; P$30 3.9,1.532; P$32 4.5,1.532 | smd 0.35 x 1: P$34 -5.775,-1.325; P$35 5.775,-1.325
2X17-RA-FEMALE = drill 1.016 pad 1.88 octagon: 1 20.32,-1.27; 2 20.32,1.27; 3 17.78,-1.27; 4 17.78,1.27; 5 15.24,-1.27; 6 15.24,1.27; 7 12.7,-1.27; 8 12.7,1.27; 9 10.16,-1.27; 10 10.16,1.27; 11 7.62,-1.27; 12 7.62,1.27; 13 5.08,-1.27; 14 5.08,1.27; 15 2.54,-1.27; 16 2.54,1.27; 17 0,-1.27; 18 0,1.27; 19 -2.54,-1.27; 20 -2.54,1.27; 21 -5.08,-1.27; 22 -5.08,1.27; 23 -7.62,-1.27; 24 -7.62,1.27; 25 -10.16,-1.27; 26 -10.16,1.27; 27 -12.7,-1.27; 28 -12.7,1.27; 29 -15.24,-1.27; 30 -15.24,1.27; 31 -17.78,-1.27; 32 -17.78,1.27; 33 -20.32,-1.27; 34 -20.32,1.27
RESC1005X35_SMD-0402 = smd 0.535 x 0.6: 1 -0.482,0; 2 0.482,0
SOP254P609X203-4 = smd 1.371 x 0.553: 1 -2.768,1.27; 2 -2.768,-1.27; 3 2.768,-1.27; 4 2.768,1.27

### Placement (x,y rotation side)
C1  25.05,46.13 90 top
C2  72.12,48.67 90 top
IC1  67.43,41.06 0 top
IC2  20.02,39.79 0 top
J1  23.28,5.5 0 top
J2  42.84,5.5 0 bottom
J3  14.94,5.5 0 top
J4  59.81,5.5 0 top
J5  41.61,58.84 180 bottom
R1  23.83,32.05 270 top
R2  19.38,28.81 90 top
R3  68.7,33.44 270 top
R4  16.71,32.05 90 top
R5  63.62,48.68 90 top
R6  66.16,48.68 90 top
R7  68.7,48.68 90 top
R8  70.73,48.68 90 top
R9  57.27,48.68 90 top
R10  57.27,43.6 90 top
R11  66.16,33.44 270 top
R12  13.39,48.78 90 top
R13  16.28,48.78 90 top
R14  18.92,48.78 90 top
R15  21.46,48.68 90 top
R16  21.29,32.05 270 top
R17  24,48.68 270 top
R18  18.76,32.1 90 top
R19  57.27,38.52 90 top
R21  57.27,33.44 90 top
R22  57.27,28.36 90 top
R23  57.27,23.28 90 top
R24  57.27,18.2 90 top
R25  57.27,13.12 90 top
R26  77.59,13.12 270 top
R27  77.59,18.2 270 top
R28  77.59,23.28 270 top
R29  77.59,28.36 270 top
R30  77.59,33.44 270 top
R31  77.59,38.52 270 top
R32  77.59,43.6 270 top
R33  77.59,48.68 270 top
R34  9.86,48.68 90 top
R35  9.86,43.6 90 top
R36  9.86,38.52 90 top
R37  9.86,33.44 90 top
R38  9.86,28.36 90 top
R39  9.86,23.28 90 top
R40  9.86,18.2 90 top
R41  9.86,13.12 90 top
R42  28.91,13.12 270 top
R43  28.91,18.2 270 top
R44  28.91,23.28 270 top
R45  28.91,28.36 270 top
R46  28.91,33.44 270 top
R47  28.91,38.52 270 top
R48  28.91,43.6 270 top
R49  28.91,48.68 270 top
RELAY1  52.19,23.28 180 top
RELAY2  52.19,18.2 180 top
RELAY3  52.19,13.12 180 top
RELAY4  82.67,13.12 0 top
RELAY5  52.19,28.36 180 top
RELAY6  52.19,33.44 180 top
RELAY7  52.19,38.52 180 top
RELAY8  52.19,43.6 180 top
RELAY10  52.19,48.68 180 top
RELAY11  82.67,18.2 0 top
RELAY12  82.67,23.28 0 top
RELAY13  82.67,28.36 0 top
RELAY14  82.67,33.44 0 top
RELAY15  82.67,38.52 0 top
RELAY16  82.67,43.6 0 top
RELAY17  82.67,48.68 0 top
RELAY18  4.78,48.68 180 top
RELAY19  4.78,43.6 180 top
RELAY20  4.78,38.52 180 top
RELAY21  4.78,33.44 180 top
RELAY22  4.78,28.36 180 top
RELAY23  4.78,23.28 180 top
RELAY24  4.78,18.2 180 top
RELAY25  4.78,13.12 180 top
RELAY26  33.99,13.12 0 top
RELAY27  33.99,18.2 0 top
RELAY28  33.99,23.28 0 top
RELAY29  33.99,28.36 0 top
RELAY30  33.99,33.44 0 top
RELAY31  33.99,38.52 0 top
RELAY32  33.99,43.6 0 top
RELAY33  33.99,48.68 0 top
U$1  [LRG-LOGO]  8.38,60.2 0 top

### Tracks (layer width: path | path; a pad name or v marks a point on that pad's centre or on a via)
AGND
  Bottom 0.152: J2.P$33 38.04,4.32 37.44,4.92 36.41,4.92 35.44,3.95 19.03,3.95 J3.2
AVCC
  Top 0.152: 86.48,45.91 RELAY16.4 | 86.48,45.91 86.48,48.91 RELAY17.4 81.17,54.22 56.23,54.22 | 86.48,45.91 86.48,40.83 | 86.48,40.83 RELAY15.4 | 86.48,40.83 86.48,35.75 | 86.48,35.75 RELAY14.4 | 86.48,35.75 86.48,30.67 | 86.48,30.67 RELAY13.4 | 86.48,30.67 86.48,25.59 | 86.48,25.59 RELAY12.4 | 86.48,25.59 86.48,20.51 | 86.48,20.51 RELAY11.4 | 86.48,20.51 86.48,15.43 RELAY4.4 | 0.97,43.37 RELAY19.4 | 0.97,43.37 0.97,46.37 RELAY18.4 2.01,48.45 7.78,54.22 32.49,54.22 | 0.97,43.37 0.97,38.29 | 0.97,38.29 RELAY20.4 | 0.97,38.29 0.97,33.21 | 0.97,33.21 RELAY21.4 | 0.97,33.21 0.97,28.13 | 0.97,28.13 RELAY22.4 | 0.97,28.13 0.97,23.05 | 0.97,23.05 RELAY23.4 | 0.97,23.05 0.97,17.97 | 0.97,17.97 RELAY24.4 | 0.97,17.97 0.97,12.89 RELAY25.4 8.36,5.5 J3.1 | 35.26,46.37 RELAY32.4 | 35.26,46.37 35.26,48.45 RELAY33.4 32.49,54.22 | 35.26,41.29 RELAY31.4 | 35.26,46.37 35.26,41.29 | 35.26,41.29 35.26,35.98 | 35.26,35.98 36.53,34.71 RELAY30.4 | 35.26,35.98 35.26,30.9 | 35.26,30.9 36.53,29.63 RELAY29.4 | 35.26,30.9 35.26,25.82 | 35.26,25.82 36.53,24.55 RELAY28.4 | 35.26,25.82 35.26,20.74 | 35.26,20.74 36.53,19.47 RELAY27.4 | RELAY26.4 35.26,15.89 35.26,20.74 | 50.92,43.83 RELAY8.4 | 50.92,43.83 50.92,45.91 RELAY10.4 56.23,54.22 | 50.92,43.83 50.92,38.75 | 50.92,38.75 RELAY7.4 | 50.92,38.75 50.92,33.67 | 50.92,33.67 RELAY6.4 | 50.92,33.67 50.92,28.59 | 50.92,28.59 RELAY5.4 | 50.92,28.59 50.92,23.51 | 50.92,23.51 RELAY1.4 | 50.92,23.51 50.92,18.43 | 50.92,18.43 RELAY2.4 | 50.92,18.43 50.92,13.35 RELAY3.4 | 32.49,54.22 56.23,54.22
GND  (via drill 0.25)
  Top 0.152: IC1.25 69.65,43.33 68.78,44.2 68.78,46.26 v69.17,46.65 | IC2.25 24.45,42.06 v24.46,42.08
  Bottom 0.152: J5.33 J5.34
  other vias: 25.03,47.59 72.09,50.1 15.7,34.84 23.83,30.65 21.42,30.65 19.38,30.21 66.12,32.04 69.17,32.04 70.69,49.95 69.04,49.95 66.12,49.95 63.71,49.95 13.16,50.2 15.7,50.2 19,50.2 21.54,50.08 24.21,47.28
  pour Top (isolate 0.406): 0.05,68.58 0.05,-0.35 87.2,-0.35 87.2,68.58
  pour Bottom: 0.33,68.6 87.13,68.6 87.13,-0.35 0.33,-0.35
N$1
  Top 0.152: IC1.23 70.14,41.82 69.43,41.82 68.7,41.08 R3.1
N$2
  Top 0.152: R7.1 66.6,46.1 66.6,43.69 66.25,43.33 IC1.4
N$3
  Top 0.152: R11.1 68.4,36.16 68.4,41.43 69.43,42.47 70.14,42.47 IC1.24
N$4
  Top 0.152: R8.1 69.84,48.2 67.09,45.45 67.09,43.55 66.23,42.69 IC1.5
N$5
  Top 0.152: R6.1 66.16,44.25 65.9,43.98 IC1.3
N$6
  Top 0.152: IC1.2 65.31,44.63 65.73,45.05 65.73,46.09 R5.1
N$7
  Top 0.152: R12.1 17.09,44.59 IC2.1
N$8
  Top 0.152: IC2.3 19.14,42.72 19.71,43.29 19.71,44.87 R13.1
N$9
  Top 0.152: IC2.4 17.31,42.28 19.13,42.28 20.03,43.17 20.03,47.07 18.92,48.17 R14.1
N$10
  Top 0.152: IC2.5 17.31,41.63 18.92,41.63 20.38,43.1 20.38,44.46 21.46,45.54 R15.1
N$11
  Top 0.152: IC2.24 22.73,41.2 22.02,41.2 20.89,40.06 20.89,32.93 R16.1
N$12
  Top 0.152: IC2.23 22.73,40.55 22.02,40.55 21.89,40.41 21.89,34.47 R1.1
N$17  (via drill 0.25)
  Top 0.152: RELAY18.3 2.24,49.95 v3.51,51.22
  Bottom 0.152: v3.51,51.22 0.79,48.5 0.79,4.05 4.24,0.6 40.53,0.6 42.62,2.69 42.62,3.75 J2.P$17
N$18  (via drill 0.25)
  Top 0.152: RELAY17.3 84.17,48.68 v83.94,48.68
  Bottom 0.152: v83.94,48.68 83.36,48.68 80.23,45.55 80.23,15.05 76.23,11.05 47.03,11.05 43.36,7.38 43.36,7.25 J2.P$16
N$19  (via drill 0.25)
  Top 0.152: RELAY16.3 84.17,43.6 v83.94,43.6
  Bottom 0.152: v83.94,43.6 86.64,40.9 86.64,3.96 83.28,0.6 46.31,0.6 43.44,3.47 J2.P$15
N$20  (via drill 0.25)
  Top 0.152: v83.94,38.52 85.21,37.25 RELAY15.3
  Bottom 0.152: v83.94,38.52 82.23,36.81 82.23,15.55 77.23,10.55 47.13,10.55 43.96,7.38 43.96,7.25 J2.P$14
N$21  (via drill 0.25)
  Top 0.152: v83.94,33.44 85.21,32.17 RELAY14.3
  Bottom 0.152: v83.94,33.44 85.73,31.65 85.73,4.05 82.68,1 46.51,1 44.04,3.47 J2.P$13
N$22  (via drill 0.25)
  Top 0.152: v83.94,28.36 85.21,27.09 RELAY13.3
  Bottom 0.152: v83.94,28.36 83.23,27.65 83.23,14.55 78.68,10 47.18,10 44.56,7.38 44.56,7.25 J2.P$12
N$23  (via drill 0.25)
  Top 0.152: v83.94,23.28 85.21,22.01 RELAY12.3
  Bottom 0.152: v83.94,23.28 85.23,21.99 85.23,4.55 82.28,1.6 46.51,1.6 44.64,3.47 J2.P$11
N$24  (via drill 0.25)
  Top 0.152: v83.94,18.2 85.21,16.93 RELAY11.3
  Bottom 0.152: v83.94,18.2 83.94,14.26 79.18,9.5 47.28,9.5 45.16,7.38 45.16,7.25 J2.P$10
N$25  (via drill 0.25)
  Top 0.152: v83.94,13.12 85.21,11.85 RELAY4.3
  Bottom 0.152: v83.94,13.12 84.23,12.83 84.23,4.55 81.73,2.05 46.66,2.05 45.24,3.47 J2.P$9
N$26  (via drill 0.25)
  Top 0.152: RELAY3.3 48.28,13.25 48.28,11 49.14,10.15 52.98,10.15 54.31,8.82 v55.73,8.82
  Bottom 0.152: J2.P$8 45.76,7.25 45.76,7.38 47.2,8.82 v55.73,8.82
N$27  (via drill 0.25)
  Top 0.152: RELAY2.3 47.68,17.73 47.68,11.09 49.02,9.75 52.88,9.75 54.5,8.13 v54.5,5.62
  Bottom 0.152: J2.P$7 46.06,3.75 46.06,3.54 47.05,2.55 53.68,2.55 54.5,3.37 v54.5,5.62
N$28  (via drill 0.25)
  Top 0.152: RELAY1.3 46.98,22.11 46.98,10.56 49.37,8.17 v51.87,8.17
  Bottom 0.152: J2.P$6 46.36,7.25 46.36,7.38 47.15,8.17 v51.87,8.17
N$29  (via drill 0.25)
  Top 0.152: RELAY5.3 46.28,26.49 46.28,9.68 50.34,5.62 v51.04,5.62
  Bottom 0.152: J2.P$5 46.66,3.75 46.66,3.54 47.25,2.95 49.68,2.95 51.04,4.31 v51.04,5.62
N$30  (via drill 0.25)
  Top 0.152: RELAY6.3 45.53,30.81 45.53,8.71 48.61,5.62 v49.31,5.62
  Bottom 0.152: J2.P$4 46.96,7.25 46.96,7.38 47.23,7.65 47.68,7.65 49.31,6.02 v49.31,5.62
N$31  (via drill 0.25)
  Top 0.152: RELAY7.3 44.69,35.05 44.69,8.52 v47.59,5.62
  Bottom 0.152: J2.P$3 47.04,3.64 47.33,3.35 47.93,3.35 48.18,3.6 48.18,5.02 v47.59,5.62
N$32  (via drill 0.25)
  Top 0.152: RELAY8.3 43.95,39.4 43.95,7.53 v45.86,5.62
  Bottom 0.152: J2.P$2 47.32,7.03 47.32,6.89 46.03,5.6 45.89,5.6 45.88,5.62 v45.86,5.62
N$33  (via drill 0.25)
  Top 0.152: RELAY10.3 43.16,43.69 43.16,6.59 v44.13,5.62
  Bottom 0.152: J2.P$1 47.64,4.29 47.23,4.7 44.88,4.7 44.13,5.45 v44.13,5.62
N$34  (via drill 0.25)
  Top 0.152: RELAY19.3 v3.51,44.87
  Bottom 0.152: v3.51,44.87 10.73,37.65 10.73,13.55 14.18,10.1 39.6,10.1 42.32,7.38 42.32,7.25 J2.P$18
N$35  (via drill 0.25)
  Top 0.152: RELAY20.3 v3.51,39.79
  Bottom 0.152: v3.51,39.79 1.23,37.51 1.23,4.55 4.83,0.95 39.98,0.95 42.02,2.99 42.02,3.75 J2.P$19
N$36  (via drill 0.25)
  Top 0.152: RELAY21.3 v3.51,34.71
  Bottom 0.152: v3.51,34.71 6.23,31.99 6.23,15.05 11.68,9.6 39.5,9.6 41.72,7.38 41.72,7.25 J2.P$20
N$37  (via drill 0.25)
  Top 0.152: RELAY22.3 v3.51,29.63
  Bottom 0.152: v3.51,29.63 3.01,29.63 1.73,28.35 1.73,5.05 5.38,1.4 39.28,1.4 41.42,3.54 41.42,3.75 J2.P$21
N$38  (via drill 0.25)
  Top 0.152: RELAY23.3 v3.51,24.55
  Bottom 0.152: v3.51,24.55 4.73,23.33 4.73,15.05 10.73,9.05 39.45,9.05 41.12,7.38 41.12,7.25 J2.P$22
N$39  (via drill 0.25)
  Top 0.152: RELAY24.3 v3.51,19.47
  Bottom 0.152: v3.51,19.47 2.23,18.19 2.23,5.55 5.93,1.85 39.13,1.85 40.82,3.54 40.82,3.75 J2.P$23
N$40  (via drill 0.25)
  Top 0.152: RELAY25.3 v3.51,14.39
  Bottom 0.152: v3.51,14.39 9.25,8.65 39.25,8.65 40.52,7.38 40.52,7.25 J2.P$24
N$41  (via drill 0.25)
  Top 0.152: RELAY26.3 34.21,11.85 30.3,7.94 v30.3,5.62
  Bottom 0.152: v30.3,5.62 30.98,6.3 37.68,6.3 37.88,6.1 37.88,5.7 38.58,5 39.48,5 40.38,5.9 40.93,5.9 41.28,5.55 41.28,5.02 40.41,4.15 40.41,3.94 J2.P$25
N$42  (via drill 0.25)
  Top 0.152: RELAY27.3 37.26,16.93 38.08,16.11 38.08,10.9 35.35,8.17 34.58,8.17 v32.03,5.62
  Bottom 0.152: v32.03,5.62 31.36,4.95 29.68,4.95 29.13,5.5 29.13,6 31.18,8.05 39.25,8.05 39.92,7.38 39.92,7.25 J2.P$26
N$43  (via drill 0.25)
  Top 0.152: RELAY28.3 37.61,22.01 38.88,20.74 38.88,10.79 34.46,6.37 v34.46,3.17
  Bottom 0.152: v34.46,3.17 34.71,3.17 35.28,2.6 38.68,2.6 39.62,3.54 39.62,3.75 J2.P$27
N$44  (via drill 0.25)
  Top 0.152: v35.99,7.02 37.12,7.02 39.53,9.43 39.53,24.31 RELAY29.3
  Bottom 0.152: v35.99,7.02 36.75,7.02 37.28,7.55 39.15,7.55 39.32,7.38 39.32,7.25 J2.P$28
N$45  (via drill 0.25)
  Top 0.152: v36.17,3.22 36.17,5.12 40.25,9.21 40.25,28.67 RELAY30.3
  Bottom 0.152: J2.P$29 39.02,3.75 39.02,3.54 38.7,3.22 v36.17,3.22
N$46  (via drill 0.25)
  Top 0.152: v38.99,6.07 40.89,7.97 40.89,33.11 RELAY31.3
  Bottom 0.152: v38.99,6.07 38.99,6.98 J2.P$30
N$52  (via drill 0.25)
  Top 0.152: v40.67,5.27 41.68,6.28 41.68,37.41 RELAY32.3
  Bottom 0.152: J2.P$31 38.86,4.19 38.86,4.4 39.11,4.65 40.05,4.65 v40.67,5.27
N$53  (via drill 0.25)
  Top 0.152: v42.4,5.62 42.42,5.64 42.42,41.75 RELAY33.3
  Bottom 0.152: J2.P$32 38.34,5.79 38.67,5.46 39.39,5.46 40.18,6.25 41.77,6.25 v42.4,5.62
N$79
  Top 0.152: RELAY7.2 56.48,39.79 R19.2
N$80
  Top 0.152: RELAY6.2 56.48,34.71 R21.2
N$81
  Top 0.152: RELAY10.2 56.48,49.95 R9.2
N$82
  Top 0.152: RELAY8.2 56.48,44.87 R10.2
N$83
  Top 0.152: RELAY5.2 56.48,29.63 R22.2
N$84
  Top 0.152: RELAY1.2 56.48,24.55 R23.2
N$85
  Top 0.152: RELAY2.2 56.48,19.47 R24.2
N$86
  Top 0.152: RELAY3.2 56.48,14.39 R25.2
N$87
  Top 0.152: R26.2 79.11,12.64 RELAY4.2
N$88
  Top 0.152: R27.2 79.11,17.72 RELAY11.2
N$89
  Top 0.152: R28.2 79.11,22.8 RELAY12.2
N$90
  Top 0.152: R29.2 79.11,27.88 RELAY13.2
N$91
  Top 0.152: R30.2 79.11,32.96 RELAY14.2
N$92
  Top 0.152: R31.2 79.11,38.04 RELAY15.2
N$93
  Top 0.152: R32.2 79.11,43.12 RELAY16.2
N$94
  Top 0.152: R33.2 79.11,48.2 RELAY17.2
N$95
  Top 0.152: RELAY18.2 9.07,49.95 R34.2
N$96
  Top 0.152: RELAY19.2 9.07,44.87 R35.2
N$97
  Top 0.152: RELAY20.2 9.07,39.79 R36.2
N$98
  Top 0.152: RELAY21.2 9.07,34.71 R37.2
N$99
  Top 0.152: RELAY22.2 9.07,29.63 R38.2
N$100
  Top 0.152: RELAY23.2 9.07,24.55 R39.2
N$101
  Top 0.152: RELAY24.2 8.34,18.68 R40.2
N$102
  Top 0.152: RELAY25.2 8.34,13.6 R41.2
N$103
  Top 0.152: R42.2 29.7,11.85 RELAY26.2
N$104
  Top 0.152: R43.2 29.7,16.93 RELAY27.2
N$105
  Top 0.152: R44.2 29.7,22.01 RELAY28.2
N$106
  Top 0.152: R45.2 29.7,27.09 RELAY29.2
N$107
  Top 0.152: R46.2 29.7,32.17 RELAY30.2
N$108
  Top 0.152: R47.2 29.7,37.25 RELAY31.2
N$109
  Top 0.152: R48.2 29.7,42.33 RELAY32.2
N$110
  Top 0.152: R49.2 29.7,47.41 RELAY33.2
SCL  (via drill 0.25)
  Top 0.152: J1.2 16.23,13.89 16.23,28.55 18.76,31.08 R18.1 18.9,31.62 19.63,32.35 19.63,41 21.12,42.5 22.73,42.5 IC2.26 24.89,42.72 26.54,44.36 26.54,51.09 24.98,52.65 22.93,52.65 v22.23,53.35 | IC1.26 72.67,43.98 74.78,46.1 74.78,49.65 v78.48,53.35 | v78.48,55.74 78.43,55.74 77.54,54.85 v22.23,54.85
  Bottom 0.152: v22.23,53.35 v22.23,54.85 | v78.48,55.74 v78.48,53.35
SDA  (via drill 0.25)
  Top 0.152: J1.1 15.23,12.36 15.23,31.05 R4.2 18.75,34.57 18.75,41.06 19.02,41.33 19.04,41.33 20.93,43.22 20.93,43.24 21.06,43.36 IC2.27 24.39,43.36 26.08,45.05 26.08,49.9 24.18,51.8 21.73,51.8 v20.23,53.3 | IC1.27 71.77,44.63 74.08,46.95 74.08,50.4 77.03,53.35 v77.23,53.35 | v20.18,55.74 v77.23,55.74
  Bottom 0.152: v77.23,55.74 v77.23,53.35 | v20.23,53.3 20.23,55.69 v20.18,55.74
SW  (via drill 0.25)
  Top 0.152: RELAY13.1 76.32,33.21 v76.32,37.25 76.32,37.34 74.87,38.78 IC1.18
  Bottom 0.152: J5.12 47.96,58.84 47.96,61.38 51.54,64.96 65.97,64.96 71.49,59.44 71.49,42.08 v76.32,37.25
SW1  (via drill 0.25)
  Top 0.152: IC1.6 61.38,42.03 v58.54,44.87 56,47.41 RELAY10.1
  Bottom 0.152: J5.1 60.73,58.91 60.73,47.06 v58.54,44.87
SW2  (via drill 0.25)
  Top 0.152: RELAY8.1 v58.54,42.33 60.65,42.33 61.38,41.6 64.29,41.6 IC1.7
  Bottom 0.152: J5.2 61.93,45.72 v58.54,42.33
SW3  (via drill 0.25)
  Top 0.152: IC1.8 62.03,40.73 v58.54,37.25 RELAY7.1
  Bottom 0.152: J5.3 58.22,58.94 58.22,57.09 58.23,57.08 58.23,47.55 56.23,45.55 56.23,39.56 v58.54,37.25
SW4  (via drill 0.25)
  Top 0.152: RELAY6.1 v58.54,32.17 59.81,33.44 59.81,37.25 62.65,40.08 IC1.9
  Bottom 0.152: J5.4 59.23,57.41 59.23,47.55 57.23,45.55 57.23,40.55 59.23,38.55 59.23,32.86 v58.54,32.17
SW5  (via drill 0.25)
  Top 0.152: RELAY5.1 v58.54,27.09 60.58,29.13 60.58,36.75 63.27,39.44 IC1.10
  Bottom 0.152: v58.54,27.09 54.73,30.9 54.73,47.84 55.48,48.59 55.48,58.74 J5.5
SW6  (via drill 0.25)
  Top 0.152: RELAY1.1 v58.54,22.01 61.35,24.82 61.35,36.34 63.8,38.78 IC1.11
  Bottom 0.152: v58.54,22.01 59.81,23.28 59.81,29.63 55.5,33.94 55.5,46.72 56.85,48.07 J5.6
SW7  (via drill 0.25)
  Top 0.152: RELAY2.1 v58.54,16.93 61.95,20.34 61.95,36.28 63.58,37.92 64.29,37.92 IC1.12
  Bottom 0.152: v58.54,16.93 55,16.93 52.94,18.99 52.94,58.74 J5.7
SW8  (via drill 0.25)
  Top 0.152: RELAY3.1 v58.54,11.85 59.81,11.85 62.89,14.93 62.89,36.58 63.58,37.27 64.29,37.27 IC1.13
  Bottom 0.152: v58.54,11.85 59.81,13.12 59.81,18.2 53.46,24.55 53.46,48.22 54.31,49.07 J5.8
SW9  (via drill 0.25)
  Top 0.152: IC1.15 71.66,36.83 72.51,35.98 72.51,18.2 v76.32,14.39 RELAY4.1
  Bottom 0.152: J5.9 54.31,62.65 64.2,62.65 67.73,59.12 67.73,22.98 v76.32,14.39
SW10  (via drill 0.25)
  Top 0.152: IC1.16 72.28,37.48 73.78,35.98 73.78,23.28 v76.32,20.74 77.59,19.47 RELAY11.1
  Bottom 0.152: J5.10 50.5,58.84 50.5,61.38 52.54,63.42 64.97,63.42 68.5,59.89 68.5,28.56 v76.32,20.74
SW11  (via drill 0.25)
  Top 0.152: IC1.17 74.17,38.13 75.05,37.25 75.05,27.09 v76.32,25.82 77.59,24.55 RELAY12.1
  Bottom 0.152: J5.11 49.23,61.38 52.04,64.19 65.47,64.19 69.97,59.69 69.97,41.06 76.32,34.71 v76.32,25.82
SW13  (via drill 0.25)
  Top 0.152: IC1.19 75.18,39.44 76.09,38.52 | 76.09,38.52 RELAY14.1 | v76.32,38.52 76.09,38.52
  Bottom 0.152: J5.13 46.69,61.65 50.77,65.73 66.47,65.73 72.64,59.56 72.64,42.2 v76.32,38.52
SW14  (via drill 0.25)
  Top 0.152: IC1.20 76.03,40.08 v76.32,39.79 RELAY15.1
  Bottom 0.152: J5.14 46.69,58.46 45.52,59.63 45.52,61.52 50.5,66.5 66.97,66.5 73.78,59.69 73.78,42.33 v76.32,39.79
SW15  (via drill 0.25)
  Top 0.152: IC1.21 72.19,40.73 v76.32,44.87 RELAY16.1
  Bottom 0.152: J5.15 44.15,61.42 50,67.27 67.47,67.27 75.05,59.69 75.05,46.14 v76.32,44.87
SW16  (via drill 0.25)
  Top 0.152: RELAY17.1 v76.32,49.95 75.86,49.49 75.86,45.68 71.56,41.38 IC1.22
  Bottom 0.152: J5.16 42.88,58.84 42.88,61.42 49.5,68.04 68.24,68.04 76.13,60.15 76.13,50.14 v76.32,49.95
SW17  (via drill 0.25)
  Top 0.152: RELAY18.1 9.86,47.41 11.13,46.14 v11.13,44.87 15.23,40.77 IC2.6
  Bottom 0.152: J5.17 41.61,62.42 37.8,66.23 17.25,66.23 11.13,60.11 v11.13,44.87
SW18  (via drill 0.25)
  Top 0.152: RELAY19.1 v12.4,42.33 14.62,40.11 IC2.7
  Bottom 0.152: J5.18 40.34,58.84 40.34,62.42 37.8,64.96 17.25,64.96 12.4,60.11 v12.4,42.33
SW19  (via drill 0.25)
  Top 0.152: RELAY20.1 11.13,37.25 v12.4,38.52 13.34,39.47 IC2.8
  Bottom 0.152: J5.19 38.57,60.61 38.57,62.15 36.53,64.19 17.75,64.19 13.67,60.11 13.67,39.79 v12.4,38.52
SW20  (via drill 0.25)
  Top 0.152: IC2.9 13.96,38.81 v12.4,37.25 11.13,35.98 11.13,32.84 10.46,32.17 RELAY21.1
  Bottom 0.152: J5.20 39.07,58.46 37.9,59.63 37.9,61.28 35.76,63.42 18.25,63.42 14.94,60.11 14.94,39.79 v12.4,37.25
SW21  (via drill 0.25)
  Top 0.152: IC2.10 14.59,38.16 v12.4,35.98 11.93,35.52 11.93,28.06 10.75,26.88 7.76,26.88 RELAY22.1
  Bottom 0.152: J5.21 36.67,60.25 36.67,61.41 35.42,62.65 18.75,62.65 16.21,60.11 16.21,39.79 v12.4,35.98
SW22  (via drill 0.25)
  Top 0.152: IC2.11 15.21,37.52 12.4,34.71 v12.4,24.55 12.4,23.45 10.96,22.01 RELAY23.1
  Bottom 0.152: J5.22 36.53,58.46 35.36,59.63 35.36,60.78 34.45,61.69 19.06,61.69 17.48,60.11 17.48,29.63 v12.4,24.55
SW23  (via drill 0.25)
  Top 0.152: RELAY24.1 9.96,16.93 12.4,19.37 | IC2.12 15.32,36.86 13.17,34.71 13.17,20.14 12.4,19.37 | 12.4,19.37 v12.4,19.47
  Bottom 0.152: J5.23 32.72,61.38 20.02,61.38 18.25,59.61 18.25,25.32 v12.4,19.47
SW24  (via drill 0.25)
  Top 0.152: RELAY25.1 11.13,11.85 v12.4,13.12 13.94,14.66 13.94,34.27 15.89,36.22 IC2.13
  Bottom 0.152: J5.24 33.99,56.3 36.53,53.76 36.53,34.71 14.94,13.12 v12.4,13.12
SW25  (via drill 0.25)
  Top 0.152: IC2.15 24.25,35.56 25.1,34.71 25.1,30.9 v25.1,25.82 25.1,18.2 v27.64,15.66 28.91,14.39 RELAY26.1
  Bottom 0.152: J5.25 31.45,59.22 32.62,58.05 32.62,56.4 35.26,53.76 35.26,34.71 26.37,25.82 v25.1,25.82
SW26  (via drill 0.25)
  Top 0.152: IC2.16 24.86,36.22 v26.37,34.71 26.37,23.28 v27.64,22.01 30.18,19.47 RELAY27.1
  Bottom 0.152: J5.26 31.45,56.3 33.99,53.76 33.99,34.71 31.45,32.17 28.91,32.17 v26.37,34.71
SW27  (via drill 0.25)
  Top 0.152: IC2.17 25.49,36.86 v26.37,35.98 27.33,35.02 27.33,28.44 RELAY28.1
  Bottom 0.152: J5.27 28.91,59.22 30.08,58.05 30.08,55.36 32.72,52.72 32.72,34.71 31.45,33.44 28.91,33.44 v26.37,35.98
SW28  (via drill 0.25)
  Top 0.152: IC2.18 26.11,37.52 v27.64,35.98 27.64,32.17 30.18,29.63 RELAY29.1
  Bottom 0.152: J5.28 28.91,54.76 31.45,52.22 31.45,35.98 30.18,34.71 28.91,34.71 v27.64,35.98
SW29  (via drill 0.25)
  Top 0.152: IC2.19 26.5,38.16 27.53,37.14 | RELAY30.1 29.95,34.71 27.53,37.14 | 27.53,37.14 29.02,37.14 v30.18,35.98
  Bottom 0.152: J5.29 27.64,58.84 27.64,54.42 30.49,51.58 30.49,42.2 30.18,41.9 v30.18,35.98
SW30  (via drill 0.25)
  Top 0.152: IC2.20 25.39,38.81 26.37,39.79 v27.64,39.79 RELAY31.1
  Bottom 0.152: J5.30 26.37,53.76 29.68,50.45 29.68,41.83 v27.64,39.79
SW31  (via drill 0.25)
  Top 0.152: IC2.21 22.98,39.43 24.1,39.43 27.65,42.98 27.65,44.86 v27.64,44.87 RELAY32.1
  Bottom 0.152: J5.31 23.83,59.91 25,58.74 25,53.86 28.91,49.95 28.91,46.14 v27.64,44.87
SW32  (via drill 0.25)
  Top 0.152: RELAY33.1 v27.64,49.95 27.64,46 27.02,45.38 27.02,43.38 23.75,40.11 IC2.22
  Bottom 0.152: J5.32 23.83,53.22 27.1,49.95 v27.64,49.95
VCC  (via drill 0.25)
  Top 0.152: IC2.28 22.95,48.11 R17.1 | R4.1 17.75,31.57 R18.2 18.98,32.8 v18.98,33.75 | IC2.2 18.14,43.36 v18.93,44.15 | v21.23,44.1 22.86,44.1 IC2.28 | IC1.1 62.38,47.41 62.38,49.55 63.51,50.68 | 72.17,46.25 73.08,47.16 73.08,50 72.41,50.68 63.51,50.68 | 72.17,46.25 71.21,45.28 IC1.28 | 63.51,50.68 64.68,51.85 v64.68,52.35 | v64.78,14.85 64.78,10.47 J4.1 55.46,1.15 30.28,1.15 28.18,3.25 28.18,9.95 20.63,17.5 v20.63,25.85 20.63,27.08 R2.1 | IC2.28 23.95,44.02 25.05,45.12 C1.1 | C2.1 72.12,46.31 72.17,46.25
  Bottom 0.152: v18.93,44.15 18.93,33.8 v18.98,33.75 | v21.23,44.1 21.23,36 v18.98,33.75 | v18.98,33.75 20.63,32.1 v20.63,25.85 | v64.78,14.85 64.68,14.95 v64.68,52.35

### Text on the board
tPlace: Rev. 1 | Multiplexing Relay Board | SW1 | GND | GND | SW2 | Designed by: Kristan Hilby | Sig + | Sig - | SDA | SCL | +5V | GND